# EAGLE schematic v0.4 (EAGLE 9.5.1)
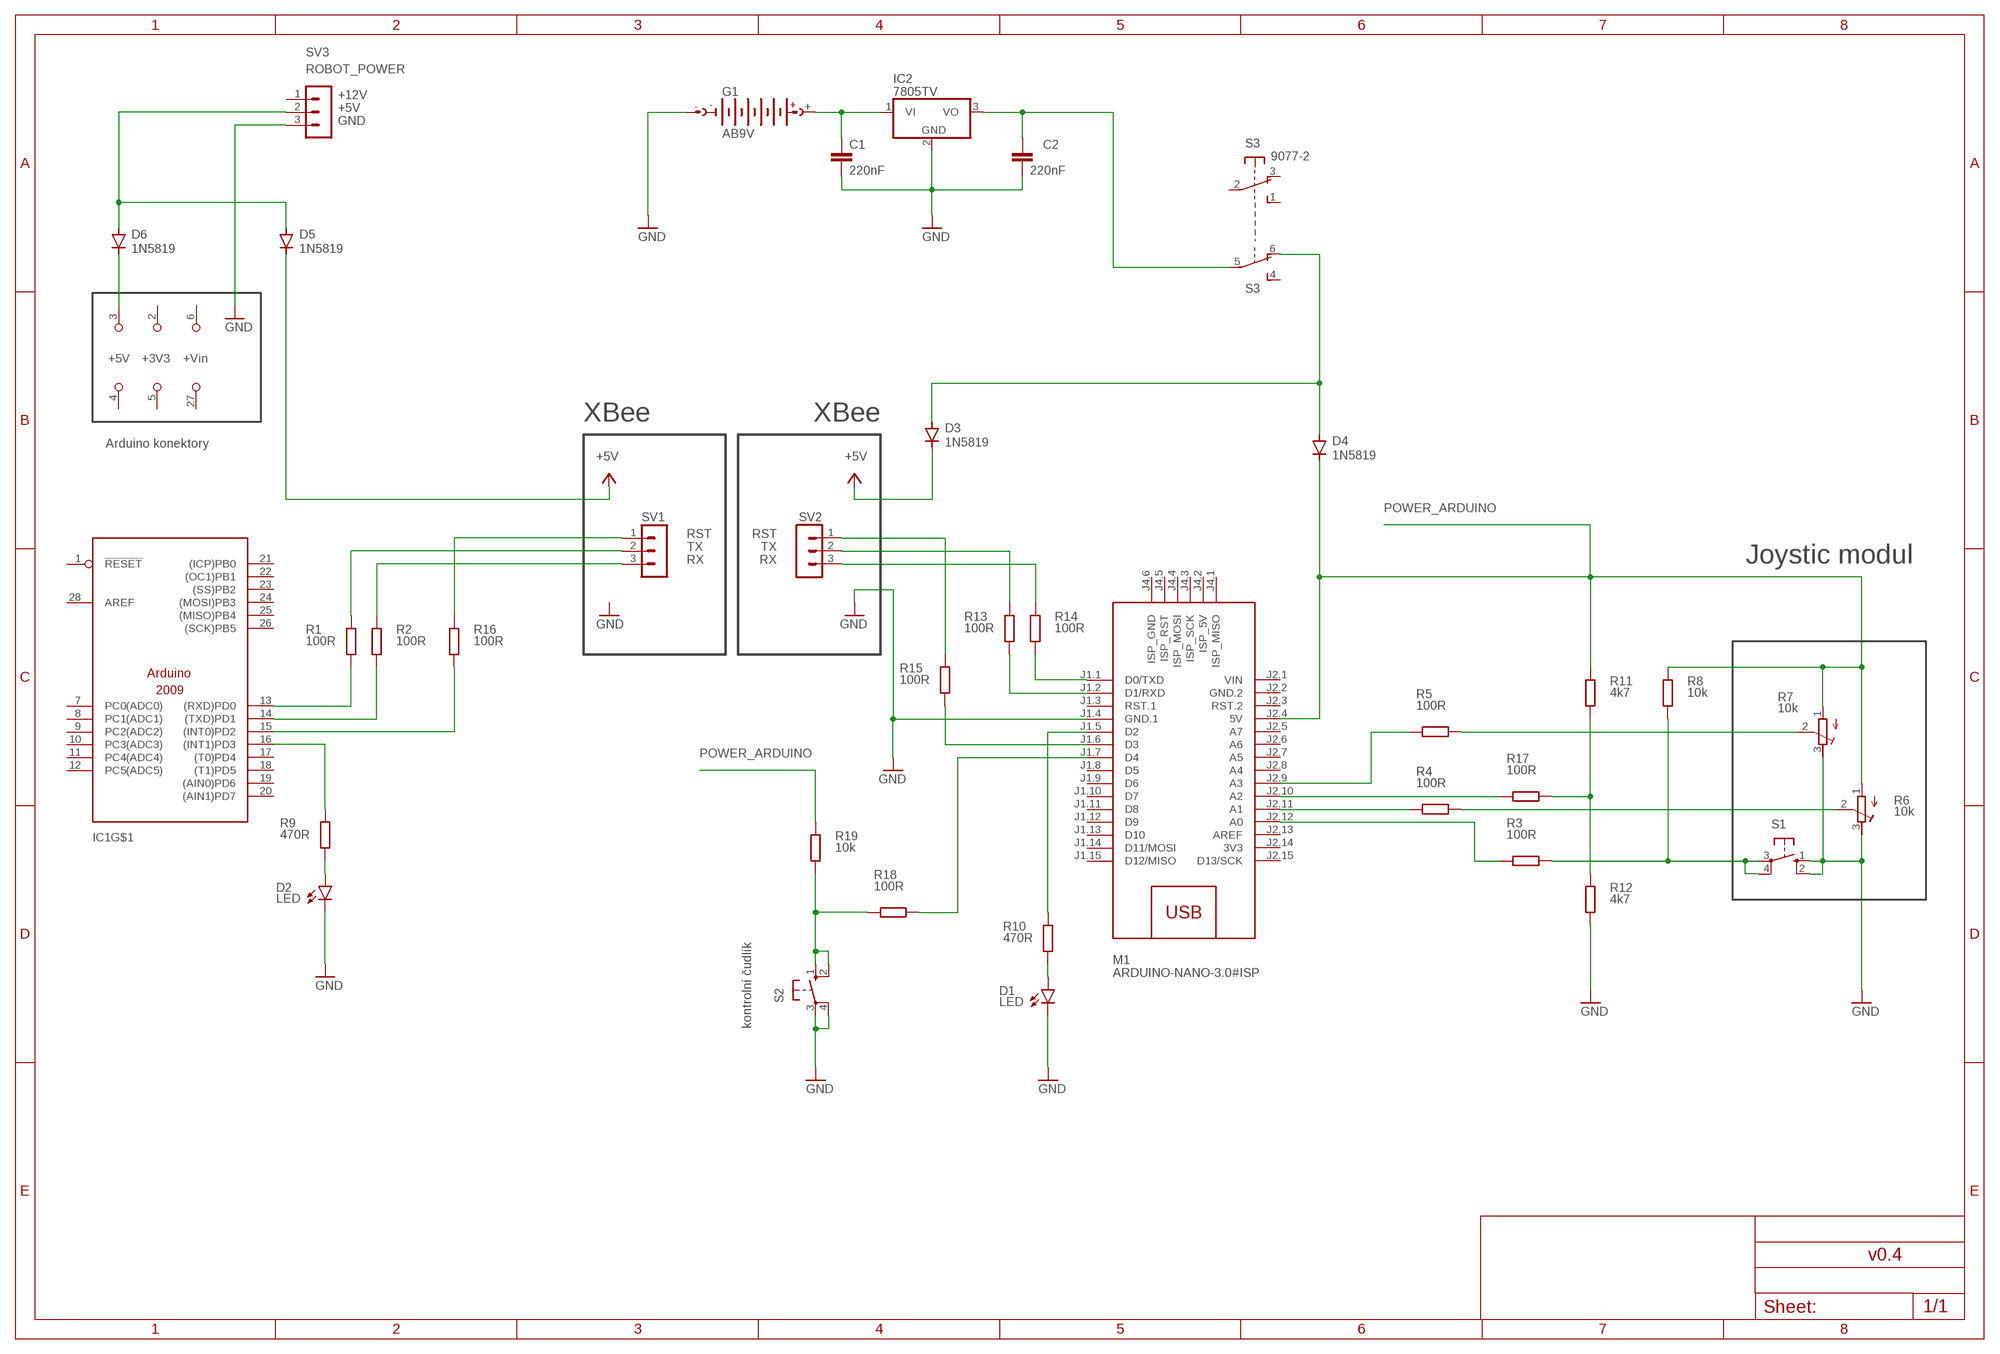
[diagram p0: schematic, sheet 1]

## Parts
C1  220nF  C-EU025-025X050  [C025-025X050]
C2  220nF  C-EU025-025X050  [C025-025X050]
D1  LED  U57X32  [U57X32]
D2  LED  U57X32  [U57X32]
D3  1N5819  DIODE-DO41-7.6  [DO41-7.6]
D4  1N5819  DIODE-DO41-7.6  [DO41-7.6]
D5  1N5819  DIODE-DO41-7.6  [DO41-7.6]
D6  1N5819  DIODE-DO41-7.6  [DO41-7.6]
G1  AB9V  [AB9V]
IC1  ARDUINO2009_PIN_22  [ARDUINO2009_2]
IC2  7805TV  [TO220V]
M1  ARDUINO-NANO-3.0#ISP  [ARDUINO-NANO-3.0#ISP]
R1  100R  R-EU_0207/7  [0207/7]
R2  100R  R-EU_0207/7  [0207/7]
R3  100R  R-EU_0207/7  [0207/7]
R4  100R  R-EU_0207/7  [0207/7]
R5  100R  R-EU_0207/7  [0207/7]
R6  10k  R-TRIMM3339P  [RTRIM3339P]
R7  10k  R-TRIMM3339P  [RTRIM3339P]
R8  10k  R-EU_0207/7  [0207/7]
R9  470R  R-EU_0207/7  [0207/7]
R10  470R  R-EU_0207/7  [0207/7]
R11  4k7  R-EU_0207/7  [0207/7]
R12  4k7  R-EU_0207/7  [0207/7]
R13  100R  R-EU_0207/7  [0207/7]
R14  100R  R-EU_0207/7  [0207/7]
R15  100R  R-EU_0207/7  [0207/7]
R16  100R  R-EU_0207/7  [0207/7]
R17  100R  R-EU_0207/7  [0207/7]
R18  100R  R-EU_0207/7  [0207/7]
R19  10k  R-EU_0207/7  [0207/7]
S1  10-XX  [B3F-10XX]
S2  10-XX  [B3F-10XX]
S3  9077-2  [9077-2]
SV1  MA03-1  [MA03-1]
SV2  MA03-1  [MA03-1]
SV3  ROBOT_POWER  MA03-1  [MA03-1]

## Nets
0V: C1.2 C2.2 D1.K(C) D2.K(C) G1.- IC2.2(GND) R6.3(E) R7.3(E) R12.1 S1.1(S) S1.2(S1) S2.3(P) S2.4(P1) SV3.3 ; supply symbol labelled GND
+5V: D3.C D5.C
GND: M1.J1.4(GND.1)
N$1: M1.J1.1(D0/TXD) R14.1
N$2: IC1.13((RXD)PD0) R1.1
N$3: R1.2 SV1.2
N$4: IC1.14((TXD)PD1) R2.1
N$5: R2.2 SV1.3
N$6: M1.J2.12(A0) R3.2
N$7: M1.J2.11(A1) R4.2
N$8: M1.J2.9(A3) R5.1
N$9: R5.2 R7.2(S)
N$10: R4.1 R6.2(S)
N$11: R3.1 R8.1 S1.3(P) S1.4(P1)
N$12: D2.A R9.1
N$13: D1.A R10.1
N$14: IC1.16((INT1)PD3) R9.2
N$15: M1.J1.5(D2) R10.2
N$16: R11.1 R12.2 R17.1
N$17: M1.J2.10(A2) R17.2
N$18: D5.A D6.A SV3.2
N$19: R13.2 SV2.2
N$20: R14.2 SV2.3
N$21: M1.J1.2(D1/RXD) R13.1
N$22: R15.2 SV2.1
N$23: M1.J1.6(D3) R15.1
N$24: R16.2 SV1.1
N$25: IC1.15((INT0)PD2) R16.1
N$26: D3.A D4.A S3.6(2:O)
N$27: C1.1 G1.+ IC2.1(VI)
N$28: C2.1 IC2.3(VO) S3.5(2:P)
N$29: R18.2 R19.1 S2.1(S) S2.2(S1)
N$30: D6.C IC1.3(+5V)
N$31: M1.J1.7(D4) R18.1
POWER_ARDUINO: D4.C M1.J2.4(5V) R6.1(A) R7.1(A) R8.2 R11.2 R19.2
Unconnected: IC1.1(!RESET) IC1.7(PC0(ADC0)) IC1.8(PC1(ADC1)) IC1.9(PC2(ADC2)) IC1.10(PC3(ADC3)) IC1.11(PC4(ADC4)) IC1.12(PC5(ADC5)) IC1.17((T0)PD4) IC1.18((T1)PD5) IC1.19((AIN0)PD6) IC1.20((AIN1)PD7) IC1.21((ICP)PB0) IC1.22((OC1)PB1) IC1.23((SS)PB2) IC1.24((MOSI)PB3) IC1.25((MISO)PB4) IC1.26((SCK)PB5) IC1.28(AREF) M1.J1.3(RST.1) M1.J1.8(D5) M1.J1.9(D6) M1.J1.10(D7) M1.J1.11(D8) M1.J1.12(D9) M1.J1.13(D10) M1.J1.14(D11/MOSI) M1.J1.15(D12/MISO) M1.J2.3(RST.2) M1.J2.5(A7) M1.J2.6(A6) M1.J2.7(A5) M1.J2.8(A4) M1.J2.13(AREF) M1.J2.15(D13/SCK) M1.J4.1(ISP_MISO) M1.J4.2(ISP_5V) M1.J4.3(ISP_SCK) M1.J4.4(ISP_MOSI) M1.J4.5(ISP_RST) M1.J4.6(ISP_GND) S3.1(1:S) S3.2(1:P) S3.3(1:O) S3.4(2:S) SV3.1

## Notes on the sheet
- +12V
- +5V
- GND
- XBee | XBee
- Arduino konektory
- RST | RST
- TX | TX
- RX | RX | Joystic modul
- kontrolní čudlík

## Power pins joined to a net without a drawn wire
3V3: M1.J2.14(3V3)
+3V3: IC1.2(+3V3)
+VIN: IC1.6(+VIN)
GND: IC1.4(GND) IC1.5(GND) IC1.27(GND)
GND.2: M1.J2.2(GND.2)
VIN: M1.J2.1(VIN)

## Library data of the parts
C1 C2 = rcl:C-EU: CAPACITOR, European symbol; SPICEPREFIX: C
D1 D2 = led:U57X32: LED rectangle, 5.7 x 3.2 mm
D3-D6 = diode:DIODE-: DIODE
G1 = battery:AB9V: 9-V BATTERY CLIP
IC1 = arduino:ARDUINO2009_PIN_2: The Arduino Duemilanove ("2009") is a microcontroller board based on the ATmega168 or ATmega328. - 14 digital input/output pins (of which 6 can be used as PWM outputs) - 6 analog inputs, a 16 MHz crystal oscillator - USB connection - power jack - ISP header - reset button It contains everything needed to support the microcontroller; simply connect it to a computer with a USB cable or power it with a AC-to-DC adapter or battery to get started http://arduino.cc/en/Main/ArduinoBoardDuemilanove
IC2 = linear:78*: Positive VOLTAGE REGULATOR Source: http://cache.national.com/ds/LM/LM78L05.pdf http://www.fairchildsemi.com/ds/LM/LM7805.pdf
M1 = diy-modules:ARDUINO-NANO-3.0#ISP: Arduino Nano 3.0 with ISP pads
R1-R5 R8-R19 = rcl:R-EU_: RESISTOR, European symbol; SPICEPREFIX: R
R6 R7 = rcl:R-TRIMM: Trimm resistor; SPICEMODEL: X; SPICEPREFIXL: POT
S1 S2 = switch-omron:10-XX: OMRON SWITCH; MPN: B3F-1000; OC_FARNELL: 176432; OC_NEWARK: 36M3542
S3 = switch-misc:9077-2: MARQUARDT SWITCH 9077.0200 Distributor: Buerklin <https://www.buerklin.com/default.asp?event=ShowArtikel%2812G2822%29&l=d&jump=ArtNr_12G2822>
SV1-SV3 = con-lstb:MA03-1: PIN HEADER; OC_FARNELL: unknown; OC_NEWARK: unknown